# EAGLE schematic single sensor (EAGLE 8.0.1)
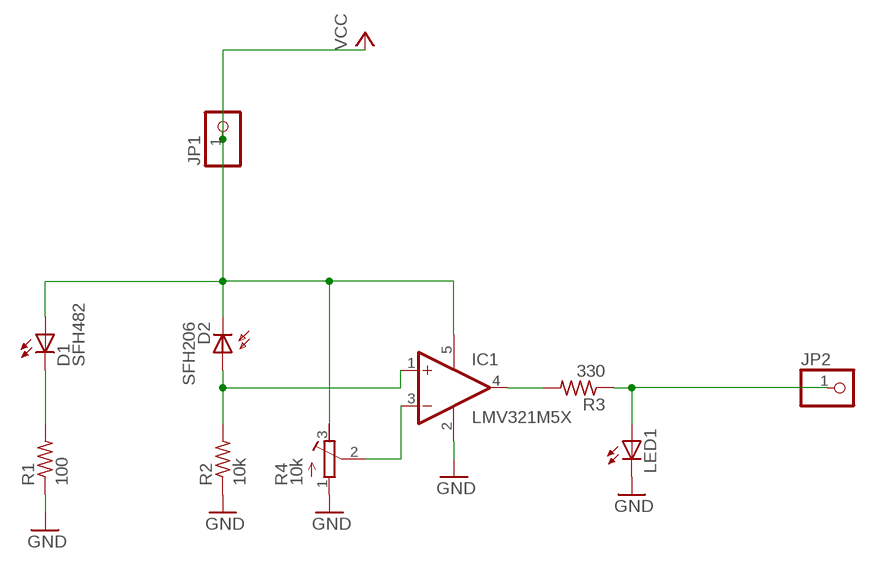
[diagram p0: schematic, sheet 1]

## Parts
D1  SFH482  [SFH482]
D2  SFH206  [SFH206]
IC1  LMV321M5X  [SOT23-5]
JP1  PINHD-1X1  [1X01]
JP2  PINHD-1X1  [1X01]
LED1  LED5MM  [LED5MM]
R1  100  R-US_0207/7  [0207/7]
R2  10k  R-US_0207/7  [0207/7]
R3  330  R-US_0207/7  [0207/7]
R4  10k  R-TRIMM5X  [RTRIM5X]

## Nets
GND: IC1.2(V-) LED1.K(C) R1.1 R2.1 R4.1(A)
N$1: D1.K(C) R1.2
N$2: D2.A IC1.1(+IN) R2.2
N$3: IC1.3(-IN) R4.2(S)
N$4: IC1.4(OUT) R3.2
N$5: JP2.1 LED1.A R3.1
VCC: D1.A D2.K(C) IC1.5(V+) JP1.1 R4.3(E)

## Library data of the parts
D1 = led:SFH482: IR LED infrared emitting diode, Infineon
D2 = opto-trans-siemens:SFH206: PHOTO DIODE; MPN: SFH206K; OC_FARNELL: 1212741; OC_NEWARK: 01M8807
IC1 = linear (2):LMV321?*: General Purpose, Low Voltage, Rail-to-Rail Output Operational Amplifiers Source: http://www.national.com/mpf/LM/LMV321.html http://www.national.com/dt/lmv_qual.pdf
JP1 JP2 = adafruit:PINHD-1X1: Pin header 1x1 for 0.1" spacing With round pins
LED1 = adafruit:LED: LED OSRAM: - CHIPLED LG R971, LG N971, LY N971, LG Q971, LY Q971, LO R971, LY R971 LH N974, LH R974 LS Q976, LO Q976, LY Q976 LO Q996 - Hyper CHIPLED LW Q18S LB Q993, LB Q99A, LB R99A - SideLED LS A670, LO A670, LY A670, LG A670, LP A670 LB A673, LV A673, LT A673, LW A673 LH A674 LY A675 LS A676, LA A676, LO A676, LY A676, LW A676 LS A679, LY A679, LG A679 - Hyper Micro SIDELED® LS Y876, LA Y876, LO Y876, LY Y876 LT Y87S - SmartLED LW L88C, LW L88S LB L89C, LB L89S, LG L890 LS L89K, LO L89K, LY L89K LS L896, LA L896, LO L896, LY L896 - TOPLED LS T670, LO T670, LY T670, LG T670, LP T670 LSG T670, LSP T670, LSY T670, LOP T670, LYG T670 LG T671, LOG T671, LSG T671 LB T673, LV T673, LT T673, LW T673 LH T674 LS T676, LA T676, LO T676, LY T676, LB T676, LH T676, LSB T676, LW T676 LB T67C, LV T67C, LT T67C, LS T67K, LO T67K, LY T67K, LW E67C LS E67B, LA E67B, LO E67B, LY E67B, LB E67C, LV E67C, LT E67C LW T67C LS T679, LY T679, LG T679 LS T770, LO T770, LY T770, LG T770, LP T770 LB T773, LV T773, LT T773, LW T773 LH T774 LS E675, LA E675, LY E675, LS T675 LS T776, LA T776, LO T776, LY T776, LB T776 LHGB T686 LT T68C, LB T68C - Hyper Mini TOPLED® LB M676 - Mini TOPLED Santana® LG M470 LS M47K, LO M47K, LY M47K Source: http://www.osram.convergy.de/
R1-R3 = adafruit:R-US_: RESISTOR, American symbol
R4 = rcl:R-TRIMM: Trimm resistor

## Net classes
0 default: width 0.305 mm, drill 0.508 mm, clearance 0.254 mm